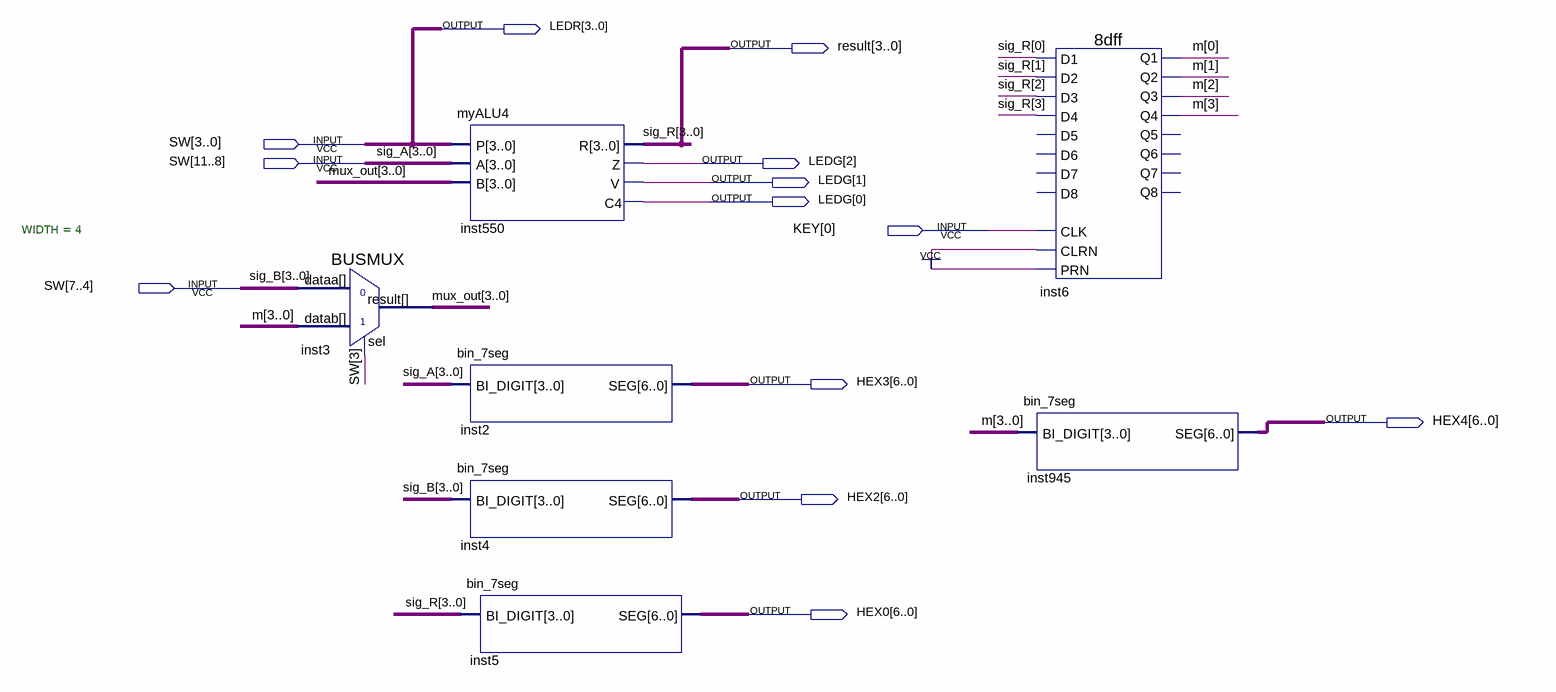
[diagram p0: schematic sheet]
// Quartus schematic Lab6_2.bdf as structural Verilog: 7 symbols, 13 pins
module Lab6_2 (
  input  [11:0] SW,
  input  [0:0] KEY,
  output [3:0] LEDR,
  output [3:0] result,
  output [2:0] LEDG,
  output [6:0] HEX3,
  output [6:0] HEX4,
  output [6:0] HEX2,
  output [6:0] HEX0
);

  wire [3:0] m, mux_out;

  BUSMUX #(.WIDTH(4)) inst3 (.datab(m), .sel(SW[3]), .dataa(SW[7:4]), .result(mux_out));
  myALU4 inst550 (.P(SW[3:0]), .A(SW[11:8]), .B(mux_out), .R(result), .Z(LEDG[2]), .V(LEDG[1]), .C4(LEDG[0]));
  bin_7seg inst2 (.BI_DIGIT(SW[11:8]), .SEG(HEX3));
  bin_7seg inst4 (.BI_DIGIT(SW[7:4]), .SEG(HEX2));
  bin_7seg inst5 (.BI_DIGIT(result), .SEG(HEX0));
  \8dff  inst6 (
    .D4(result[3]), .D3(result[2]), .PRN(1'b1), .CLK(KEY[0]), .CLRN(1'b1), .D2(result[1]), .D1(result[0]),
    .Q1(m[0]), .Q4(m[3]), .Q3(m[2]), .Q2(m[1]));  // open: D5, D8, D7, D6, Q8, Q5, Q6, Q7
  bin_7seg inst945 (.BI_DIGIT(m), .SEG(HEX4));

  assign LEDR = SW[3:0];

  // Other names for the same wires on the sheet: sig_A[3:0] = SW[11:8]; sig_B[3:0] = SW[7:4]; sig_R[3:0] = result
endmodule
